# Altium schematic sheet MAIN.SchDoc
size 420 x 297 mm; SheetNumber: 1; SheetTotal: 20
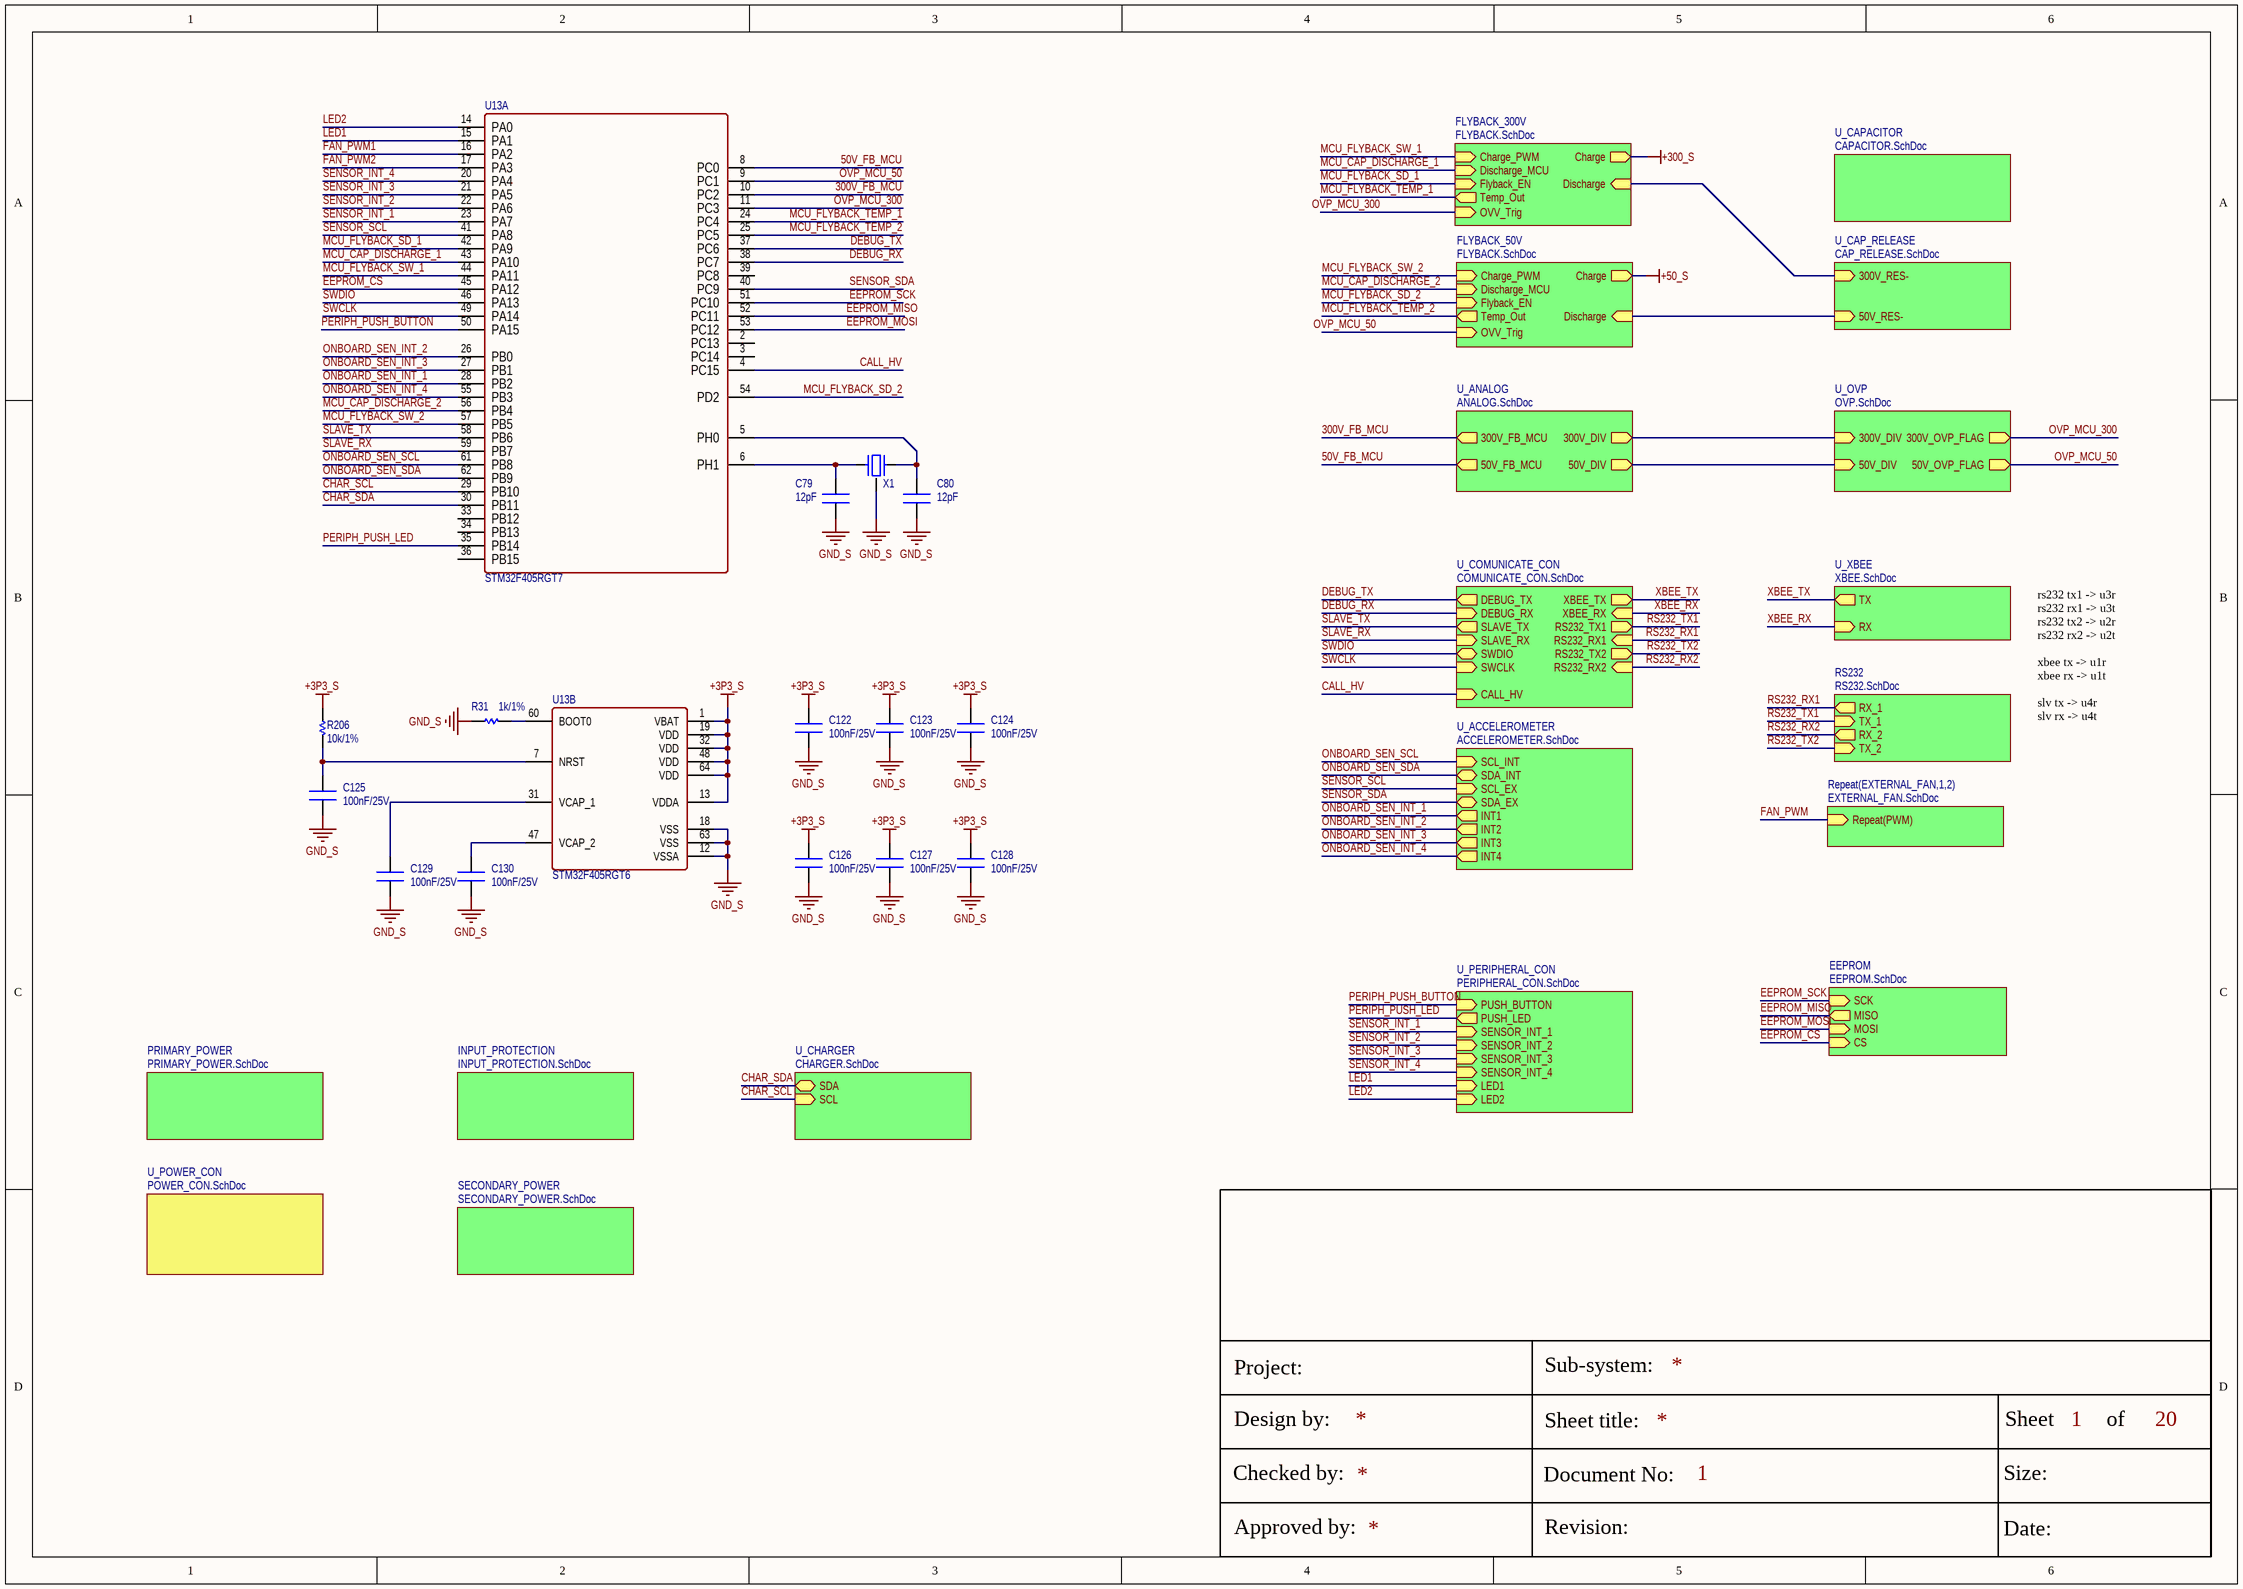
[diagram p0: MAIN.SchDoc]

## Parts
C79  12pF  [CN-SMD-0603]
C80  12pF  [CN-SMD-0603]
C122  100nF/25V  [CN-SMD-0603]
C123  100nF/25V  [CN-SMD-0603]
C124  100nF/25V  [CN-SMD-0603]
C125  100nF/25V  [CN-SMD-0603]
C126  100nF/25V  [CN-SMD-0603]
C127  100nF/25V  [CN-SMD-0603]
C128  100nF/25V  [CN-SMD-0603]
C129  100nF/25V  [CN-SMD-0603]
C130  100nF/25V  [CN-SMD-0603]
R31  1k/1%  [RES-SMD-0603]
R206  10k/1%  [RES-SMD-0603]
U13  STM32F405RGT7  [LQFP64]  (parts A,B of 2)
X1  XTAL_8MHz  [XT4-16.000MHz-4_V]  (value not drawn)

## Sub-sheets
EEPROM = EEPROM.SchDoc: SCK (in), MISO (out), MOSI (in), CS (in)
FLYBACK_50V = FLYBACK.SchDoc: Discharge (in), Charge (out), Charge_PWM (in), Discharge_MCU (in), Flyback_EN (in), Temp_Out (out), OVV_Trig (in)  | R2_Value: 2K
FLYBACK_300V = FLYBACK.SchDoc: Discharge (in), Charge (out), Charge_PWM (in), Discharge_MCU (in), Flyback_EN (in), Temp_Out (out), OVV_Trig (in)  | R2_Value: 1K
INPUT_PROTECTION = INPUT_PROTECTION.SchDoc: no entries
PRIMARY_POWER = PRIMARY_POWER.SchDoc: no entries
Repeat(EXTERNAL_FAN,1,2) = EXTERNAL_FAN.SchDoc: Repeat(PWM) (in)
RS232 = RS232.SchDoc: RX_1 (out), TX_1 (in), RX_2 (out), TX_2 (in)
SECONDARY_POWER = SECONDARY_POWER.SchDoc: no entries
U_ACCELEROMETER = ACCELEROMETER.SchDoc: SCL_INT (in), SDA_INT (bidir), INT1 (out), INT2 (out), SCL_EX (in), SDA_EX (bidir), INT3 (out), INT4 (out)
U_ANALOG = ANALOG.SchDoc: 300V_FB_MCU (out), 50V_FB_MCU (out), 50V_DIV (out), 300V_DIV (out)
U_CAP_RELEASE = CAP_RELEASE.SchDoc: 300V_RES- (in), 50V_RES- (in)
U_CAPACITOR = CAPACITOR.SchDoc: no entries
U_CHARGER = CHARGER.SchDoc: SDA (bidir), SCL (in)
U_COMUNICATE_CON = COMUNICATE_CON.SchDoc: XBEE_TX (out), XBEE_RX (in), RS232_TX1 (out), RS232_RX1 (in), SLAVE_TX (out), SWDIO (bidir), SWCLK (in), DEBUG_TX (out), DEBUG_RX (in), RS232_TX2 (out), RS232_RX2 (in), SLAVE_RX (in), CALL_HV (in)
U_OVP = OVP.SchDoc: 300V_OVP_FLAG (out), 300V_DIV (in), 50V_OVP_FLAG (out), 50V_DIV (in)
U_PERIPHERAL_CON = PERIPHERAL_CON.SchDoc: PUSH_BUTTON (in), PUSH_LED (out), SENSOR_INT_1 (in), SENSOR_INT_2 (in), SENSOR_INT_3 (in), SENSOR_INT_4 (in), LED1 (in), LED2 (in)
U_POWER_CON = POWER_CON.SchDoc: no entries
U_XBEE = XBEE.SchDoc: TX (out), RX (in)

## Nets
+3P3_S: C122.1 C123.1 C124.1 C126.1 C127.1 C128.1 R206.2 U13.1(VBAT) U13.13(VDDA) U13.19(VDD) U13.32(VDD) U13.48(VDD) U13.64(VDD)
+50_S: sheet FLYBACK_50V/Charge
+300_S: sheet FLYBACK_300V/Charge
GND_S: C79.1 C80.1 C122.2 C123.2 C124.2 C125.2 C126.2 C127.2 C128.2 C129.2 C130.2 R31.2 U13.12(VSSA) U13.18(VSS) U13.63(VSS) X1.2,4(GND)
50V_FB_MCU: U13.8(PC0) ; sheet U_ANALOG/50V_FB_MCU
300V_FB_MCU: U13.10(PC2) ; sheet U_ANALOG/300V_FB_MCU
CALL_HV: U13.4(PC15) ; sheet U_COMUNICATE_CON/CALL_HV
CHAR_SCL: U13.29(PB10) ; sheet U_CHARGER/SCL
CHAR_SDA: U13.30(PB11) ; sheet U_CHARGER/SDA
DEBUG_RX: U13.38(PC7) ; sheet U_COMUNICATE_CON/DEBUG_RX
DEBUG_TX: U13.37(PC6) ; sheet U_COMUNICATE_CON/DEBUG_TX
EEPROM_CS: U13.45(PA12) ; sheet EEPROM/CS
EEPROM_MISO: U13.52(PC11) ; sheet EEPROM/MISO
EEPROM_MOSI: U13.53(PC12) ; sheet EEPROM/MOSI
EEPROM_SCK: U13.51(PC10) ; sheet EEPROM/SCK
FAN_PWM: sheet Repeat(EXTERNAL_FAN,1,2)/Repeat(PWM)
FAN_PWM1: U13.16(PA2)
FAN_PWM2: U13.17(PA3)
LED1: U13.15(PA1) ; sheet U_PERIPHERAL_CON/LED1
LED2: U13.14(PA0) ; sheet U_PERIPHERAL_CON/LED2
MCU_CAP_DISCHARGE_1: U13.43(PA10) ; sheet FLYBACK_300V/Discharge_MCU
MCU_CAP_DISCHARGE_2: U13.56(PB4) ; sheet FLYBACK_50V/Discharge_MCU
MCU_FLYBACK_SD_1: U13.42(PA9) ; sheet FLYBACK_300V/Flyback_EN
MCU_FLYBACK_SD_2: U13.54(PD2) ; sheet FLYBACK_50V/Flyback_EN
MCU_FLYBACK_SW_1: U13.44(PA11) ; sheet FLYBACK_300V/Charge_PWM
MCU_FLYBACK_SW_2: U13.57(PB5) ; sheet FLYBACK_50V/Charge_PWM
MCU_FLYBACK_TEMP_1: U13.24(PC4) ; sheet FLYBACK_300V/Temp_Out
MCU_FLYBACK_TEMP_2: U13.25(PC5) ; sheet FLYBACK_50V/Temp_Out
ONBOARD_SEN_INT_1: U13.28(PB2) ; sheet U_ACCELEROMETER/INT1
ONBOARD_SEN_INT_2: U13.26(PB0) ; sheet U_ACCELEROMETER/INT2
ONBOARD_SEN_INT_3: U13.27(PB1) ; sheet U_ACCELEROMETER/INT3
ONBOARD_SEN_INT_4: U13.55(PB3) ; sheet U_ACCELEROMETER/INT4
ONBOARD_SEN_SCL: U13.61(PB8) ; sheet U_ACCELEROMETER/SCL_INT
ONBOARD_SEN_SDA: U13.62(PB9) ; sheet U_ACCELEROMETER/SDA_INT
OVP_MCU_50: U13.9(PC1) ; sheet FLYBACK_50V/OVV_Trig, sheet U_OVP/50V_OVP_FLAG
OVP_MCU_300: U13.11(PC3) ; sheet FLYBACK_300V/OVV_Trig, sheet U_OVP/300V_OVP_FLAG
PERIPH_PUSH_BUTTON: U13.50(PA15) ; sheet U_PERIPHERAL_CON/PUSH_BUTTON
PERIPH_PUSH_LED: U13.35(PB14) ; sheet U_PERIPHERAL_CON/PUSH_LED
RS232_RX1: sheet RS232/RX_1, sheet U_COMUNICATE_CON/RS232_RX1
RS232_RX2: sheet RS232/RX_2, sheet U_COMUNICATE_CON/RS232_RX2
RS232_TX1: sheet RS232/TX_1, sheet U_COMUNICATE_CON/RS232_TX1
RS232_TX2: sheet RS232/TX_2, sheet U_COMUNICATE_CON/RS232_TX2
SENSOR_INT_1: U13.23(PA7) ; sheet U_PERIPHERAL_CON/SENSOR_INT_1
SENSOR_INT_2: U13.22(PA6) ; sheet U_PERIPHERAL_CON/SENSOR_INT_2
SENSOR_INT_3: U13.21(PA5) ; sheet U_PERIPHERAL_CON/SENSOR_INT_3
SENSOR_INT_4: U13.20(PA4) ; sheet U_PERIPHERAL_CON/SENSOR_INT_4
SENSOR_SCL: U13.41(PA8) ; sheet U_ACCELEROMETER/SCL_EX
SENSOR_SDA: U13.40(PC9) ; sheet U_ACCELEROMETER/SDA_EX
SLAVE_RX: U13.59(PB7) ; sheet U_COMUNICATE_CON/SLAVE_RX
SLAVE_TX: U13.58(PB6) ; sheet U_COMUNICATE_CON/SLAVE_TX
SWCLK: U13.49(PA14) ; sheet U_COMUNICATE_CON/SWCLK
SWDIO: U13.46(PA13) ; sheet U_COMUNICATE_CON/SWDIO
XBEE_RX: sheet U_XBEE/RX, sheet U_COMUNICATE_CON/XBEE_RX
XBEE_TX: sheet U_XBEE/TX, sheet U_COMUNICATE_CON/XBEE_TX
NetC79_2: C79.2 U13.6(PH1) X1.3
NetC80_2: C80.2 U13.5(PH0) X1.1
NetC125_1: C125.1 R206.1 U13.7(NRST)
NetC129_1: C129.1 U13.31(VCAP_1)
NetC130_1: C130.1 U13.47(VCAP_2)
NetR31_1: R31.1 U13.60(BOOT0)
(unnamed): sheet FLYBACK_300V/Discharge, sheet U_CAP_RELEASE/300V_RES-
(unnamed): sheet FLYBACK_50V/Discharge, sheet U_CAP_RELEASE/50V_RES-
(unnamed): sheet U_ANALOG/50V_DIV, sheet U_OVP/50V_DIV
(unnamed): sheet U_ANALOG/300V_DIV, sheet U_OVP/300V_DIV

Not connected (* = marked no-connect by the designer): U13 2(PC13) 3(PC14) 33(PB12) 34(PB13) 36(PB15) 39(PC8)

## Notes on the sheet
- rs232 tx1 -> u3r
  rs232 rx1 -> u3t
  rs232 tx2 -> u2r
  rs232 rx2 -> u2t
  xbee tx -> u1r
  xbee rx -> u1t
  slv tx -> u4r
  slv rx -> u4t
- Project:
- Sub-system:
- Design by:
- Sheet title:
- Sheet
- of
- Checked by:
- Approved by:
- Document No:
- Revision:
- Size:
- Date:

## Library data of the parts
C79 C80 = CN: CAP CER 12PF 50V C0G/NP0 0603; PN: CL10C120JB81PNC
C122-C130 = CN: CAP CER 0.1UF 25V X7R 0603; PN: CL10B104KA8NNNC
R31 = Res-SMD: RES SMD 1K OHM 1% 1/10W 0603; Manufacturer: Generic Components; PN: ERJ-3EKF1001V; Class: Passive; Publisher: Altium Hobart Technology Centre
R206 = Res-SMD: RES SMD 10K OHM 1% 1/10W 0603; Manufacturer: Generic Components; PN: ERJ-3EKF1002V; Class: Passive; Publisher: Altium Hobart Technology Centre
U13 = STM32F405RGT6: High-performance foundation line, ARM Cortex-M4 core with DSP and FPU, 1 Mbyte Flash, 168 MHz CPU, ART Accelerator; PN: STM32F405RGT6
X1 = XT4: CRYSTAL 8.0000MHZ 8PF SMD; PN: ECS-80-8-33Q-ADS